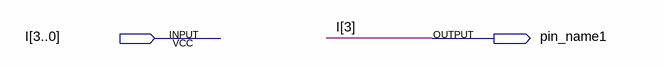
[diagram p0: schematic sheet]
// Quartus schematic NEG.bdf as structural Verilog: 0 symbols, 2 pins
module NEG (
  input  [3:0] I,
  output pin_name1
);


  assign pin_name1 = I[3];
endmodule
